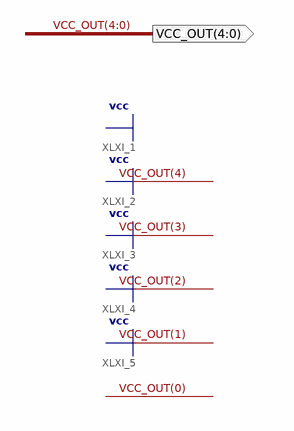
[diagram p0: schematic sheet 1]
// Xilinx ISE schematic VCC_5.sch (artix7) as structural Verilog: 0 symbols, 1 ports
module VCC_5 (
  output [4:0] VCC_OUT
);


  assign VCC_OUT = {5{1'b1}};
endmodule
